# Altium schematic sheet SCH2_Main_Computer.SchDoc: Main Computer
size B; Organization: CWRUbotix; Address1: 10900 Euclid Avenue; Address2: Cleveland, OH 44106; Address3: USA; Revision: 1.0; SheetNumber: 2; SheetTotal: 13
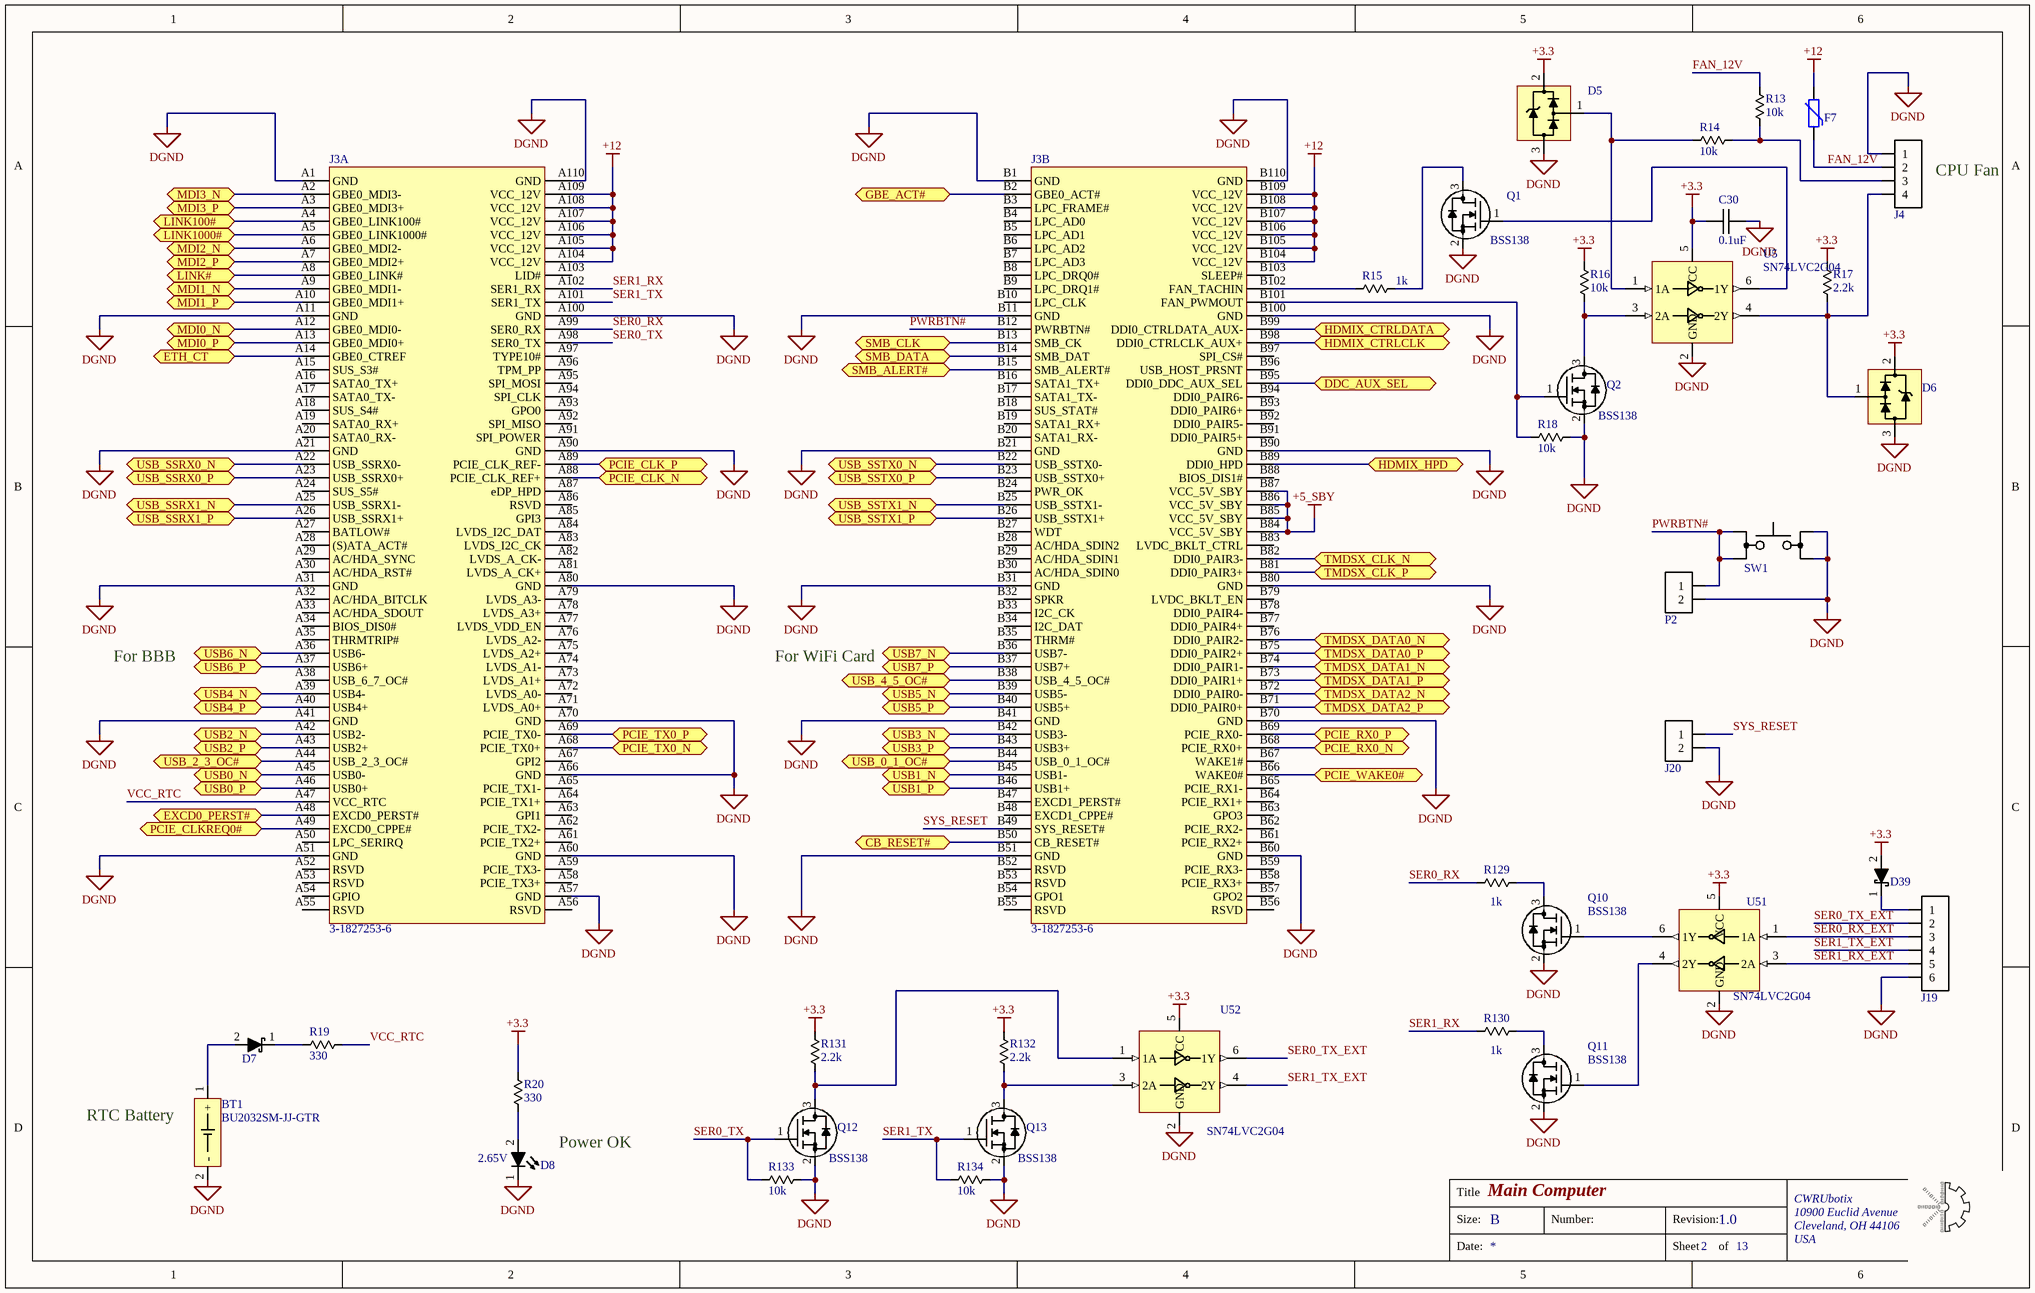
[diagram p0: SCH2_Main_Computer.SchDoc]

## Parts
BT1  BU2032SM-JJ-GTR  [BU2032SM-JJ-GTR]
C30  0.1uF  [chip_0603]
D5  DLPT05  [sot-23-3]  (value not drawn)
D6  DLPT05  [sot-23-3]  (value not drawn)
D7  diode_2  [sod123_0]  (value not drawn)
D8  Forward Voltage: 2.65V  [chip_0603_LED]  (hidden comment: diode_4)
D39  diode_2  [sod123_0]  (value not drawn)
F7  PTC_0  [chip_1210]  (value not drawn)
J3  3-1827253-6  [TE_CONN_1827253]  (parts A,B of 2)
J4  conn-4x1_0  [MOLEX_0470531000]  (value not drawn)
J19  conn-6x1_0  [HDDR_6X1_0]  (value not drawn)
J20  conn-2x1_0  [HDDR_2x1_0]  (value not drawn)
P2  conn-2x1_0  [HDDR_2x1_0]  (value not drawn)
Q1  Manufacturer PN: BSS138  [sot-23-3]  (hidden comment: n-mosfet_1)
Q2  Manufacturer PN: BSS138  [sot-23-3]  (hidden comment: n-mosfet_1)
Q10  Manufacturer PN: BSS138  [sot-23-3]  (hidden comment: n-mosfet_1)
Q11  Manufacturer PN: BSS138  [sot-23-3]  (hidden comment: n-mosfet_1)
Q12  Manufacturer PN: BSS138  [sot-23-3]  (hidden comment: n-mosfet_1)
Q13  Manufacturer PN: BSS138  [sot-23-3]  (hidden comment: n-mosfet_1)
R13  10k  [chip_0603]
R14  10k  [chip_0603]
R15  1k  [chip_0603]
R16  10k  [chip_0603]
R17  2.2k  [chip_0603]
R18  10k  [chip_0603]
R19  330  [chip_0603]
R20  330  [chip_0603]
R129  1k  [chip_0603]
R130  1k  [chip_0603]
R131  2.2k  [chip_0603]
R132  2.2k  [chip_0603]
R133  10k  [chip_0603]
R134  10k  [chip_0603]
SW1  SW_1P1T_2  [B3FS-1000]  (value not drawn)
U5  SN74LVC2G04  [sot-23-6]
U51  SN74LVC2G04  [sot-23-6]
U52  SN74LVC2G04  [sot-23-6]

## Ports
CB_RESET# (bidir), DDC_AUX_SEL (bidir), ETH_CT (bidir), EXCD0_PERST# (bidir), GBE_ACT# (bidir), HDMIX_CTRLCLK (bidir), HDMIX_CTRLDATA (bidir), HDMIX_HPD (bidir), LINK100# (bidir), LINK1000# (bidir), LINK# (bidir), MDI0_N (bidir), MDI0_P (bidir), MDI1_N (bidir), MDI1_P (bidir), MDI2_N (bidir), MDI2_P (bidir), MDI3_N (bidir), MDI3_P (bidir), PCIE_CLK_N (bidir), PCIE_CLK_P (bidir), PCIE_CLKREQ0# (bidir), PCIE_RX0_N (bidir), PCIE_RX0_P (bidir), PCIE_TX0_N (bidir), PCIE_TX0_P (bidir), PCIE_WAKE0# (bidir), SMB_ALERT# (bidir), SMB_CLK (bidir), SMB_DATA (bidir), TMDSX_CLK_N (bidir), TMDSX_CLK_P (bidir), TMDSX_DATA0_N (bidir), TMDSX_DATA0_P (bidir), TMDSX_DATA1_N (bidir), TMDSX_DATA1_P (bidir), TMDSX_DATA2_N (bidir), TMDSX_DATA2_P (bidir), USB0_N (bidir), USB0_P (bidir), USB1_N (bidir), USB1_P (bidir), USB2_N (bidir), USB2_P (bidir), USB3_N (bidir), USB3_P (bidir), USB4_N (bidir), USB4_P (bidir), USB5_N (bidir), USB5_P (bidir), USB6_N (bidir), USB6_P (bidir), USB7_N (bidir), USB7_P (bidir), USB_0_1_OC# (bidir), USB_2_3_OC# (bidir), USB_4_5_OC# (bidir), USB_SSRX0_N (bidir), USB_SSRX0_P (bidir), USB_SSRX1_N (bidir), USB_SSRX1_P (bidir), USB_SSTX0_N (bidir), USB_SSTX0_P (bidir), USB_SSTX1_N (bidir), USB_SSTX1_P (bidir)

## Nets
+3.3: C30.1 D5.2(VCC) D6.2(VCC) D39.2 R16.1 R17.1 R20.2 R131.1 R132.1 U5.5(VCC) U51.5(VCC) U52.5(VCC)
+5_SBY: J3.B84(VCC_5V_SBY) J3.B85(VCC_5V_SBY) J3.B86(VCC_5V_SBY) J3.B87(VCC_5V_SBY)
+12: F7.2 J3.A104(VCC_12V) J3.A105(VCC_12V) J3.A106(VCC_12V) J3.A107(VCC_12V) J3.A108(VCC_12V) J3.A109(VCC_12V) J3.B104(VCC_12V) J3.B105(VCC_12V) J3.B106(VCC_12V) J3.B107(VCC_12V) J3.B108(VCC_12V) J3.B109(VCC_12V)
DGND: BT1.2(-) C30.2 D5.3(GND) D6.3(GND) D8.1 J3.A1(GND) J3.A11(GND) J3.A21(GND) J3.A31(GND) J3.A41(GND) J3.A51(GND) J3.A57(GND) J3.A60(GND) J3.A66(GND) J3.A70(GND) J3.A80(GND) J3.A90(GND) J3.A100(GND) J3.A110(GND) J3.B1(GND) J3.B11(GND) J3.B21(GND) J3.B31(GND) J3.B41(GND) J3.B51(GND) J3.B60(GND) J3.B70(GND) J3.B80(GND) J3.B90(GND) J3.B100(GND) J3.B110(GND) J4.1 J19.6 J20.2 P2.2 Q1.2(S) Q2.2(S) Q10.2(S) Q11.2(S) Q12.2(S) Q13.2(S) R18.2 R133.2 R134.2 SW1.3 SW1.4 U5.2(GND) U51.2(GND) U52.2(GND)
CB_RESET#: J3.B50(CB_RESET#) ; port CB_RESET#
DDC_AUX_SEL: J3.B95(DDI0_DDC_AUX_SEL) ; port DDC_AUX_SEL
ETH_CT: J3.A14(GBE0_CTREF) ; port ETH_CT
EXCD0_PERST#: J3.A48(EXCD0_PERST#) ; port EXCD0_PERST#
FAN_12V: F7.1 J4.2 R13.2
GBE_ACT#: J3.B2(GBE0_ACT#) ; port GBE_ACT#
HDMIX_CTRLCLK: J3.B98(DDI0_CTRLCLK_AUX+) ; port HDMIX_CTRLCLK
HDMIX_CTRLDATA: J3.B99(DDI0_CTRLDATA_AUX-) ; port HDMIX_CTRLDATA
HDMIX_HPD: J3.B89(DDI0_HPD) ; port HDMIX_HPD
LINK100#: J3.A4(GBE0_LINK100#) ; port LINK100#
LINK1000#: J3.A5(GBE0_LINK1000#) ; port LINK1000#
LINK#: J3.A8(GBE0_LINK#) ; port LINK#
MDI0_N: J3.A12(GBE0_MDI0-) ; port MDI0_N
MDI0_P: J3.A13(GBE0_MDI0+) ; port MDI0_P
MDI1_N: J3.A9(GBE0_MDI1-) ; port MDI1_N
MDI1_P: J3.A10(GBE0_MDI1+) ; port MDI1_P
MDI2_N: J3.A6(GBE0_MDI2-) ; port MDI2_N
MDI2_P: J3.A7(GBE0_MDI2+) ; port MDI2_P
MDI3_N: J3.A2(GBE0_MDI3-) ; port MDI3_N
MDI3_P: J3.A3(GBE0_MDI3+) ; port MDI3_P
PCIE_CLK_N: J3.A88(PCIE_CLK_REF+) ; port PCIE_CLK_N
PCIE_CLK_P: J3.A89(PCIE_CLK_REF-) ; port PCIE_CLK_P
PCIE_CLKREQ0#: J3.A49(EXCD0_CPPE#) ; port PCIE_CLKREQ0#
PCIE_RX0_N: J3.B68(PCIE_RX0+) ; port PCIE_RX0_N
PCIE_RX0_P: J3.B69(PCIE_RX0-) ; port PCIE_RX0_P
PCIE_TX0_N: J3.A68(PCIE_TX0+) ; port PCIE_TX0_N
PCIE_TX0_P: J3.A69(PCIE_TX0-) ; port PCIE_TX0_P
PCIE_WAKE0#: J3.B66(WAKE0#) ; port PCIE_WAKE0#
PWRBTN#: J3.B12(PWRBTN#) P2.1 SW1.1 SW1.2
SER0_RX: J3.A99(SER0_RX) R129.1
SER0_RX_EXT: J19.3 U51.1(1A)
SER0_TX: J3.A98(SER0_TX) Q12.1(G) R133.1
SER0_TX_EXT: J19.2 U52.6(1Y)
SER1_RX: J3.A102(SER1_RX) R130.1
SER1_RX_EXT: J19.5 U51.3(2A)
SER1_TX: J3.A101(SER1_TX) Q13.1(G) R134.1
SER1_TX_EXT: J19.4 U52.4(2Y)
SMB_ALERT#: J3.B15(SMB_ALERT#) ; port SMB_ALERT#
SMB_CLK: J3.B13(SMB_CK) ; port SMB_CLK
SMB_DATA: J3.B14(SMB_DAT) ; port SMB_DATA
SYS_RESET: J3.B49(SYS_RESET#) J20.1
TMDSX_CLK_N: J3.B82(DDI0_PAIR3-) ; port TMDSX_CLK_N
TMDSX_CLK_P: J3.B81(DDI0_PAIR3+) ; port TMDSX_CLK_P
TMDSX_DATA0_N: J3.B76(DDI0_PAIR2-) ; port TMDSX_DATA0_N
TMDSX_DATA0_P: J3.B75(DDI0_PAIR2+) ; port TMDSX_DATA0_P
TMDSX_DATA1_N: J3.B74(DDI0_PAIR1-) ; port TMDSX_DATA1_N
TMDSX_DATA1_P: J3.B73(DDI0_PAIR1+) ; port TMDSX_DATA1_P
TMDSX_DATA2_N: J3.B72(DDI0_PAIR0-) ; port TMDSX_DATA2_N
TMDSX_DATA2_P: J3.B71(DDI0_PAIR0+) ; port TMDSX_DATA2_P
USB0_N: J3.A45(USB0-) ; port USB0_N
USB0_P: J3.A46(USB0+) ; port USB0_P
USB1_N: J3.B45(USB1-) ; port USB1_N
USB1_P: J3.B46(USB1+) ; port USB1_P
USB2_N: J3.A42(USB2-) ; port USB2_N
USB2_P: J3.A43(USB2+) ; port USB2_P
USB3_N: J3.B42(USB3-) ; port USB3_N
USB3_P: J3.B43(USB3+) ; port USB3_P
USB4_N: J3.A39(USB4-) ; port USB4_N
USB4_P: J3.A40(USB4+) ; port USB4_P
USB5_N: J3.B39(USB5-) ; port USB5_N
USB5_P: J3.B40(USB5+) ; port USB5_P
USB6_N: J3.A36(USB6-) ; port USB6_N
USB6_P: J3.A37(USB6+) ; port USB6_P
USB7_N: J3.B36(USB7-) ; port USB7_N
USB7_P: J3.B37(USB7+) ; port USB7_P
USB_0_1_OC#: J3.B44(USB_0_1_OC#) ; port USB_0_1_OC#
USB_2_3_OC#: J3.A44(USB_2_3_OC#) ; port USB_2_3_OC#
USB_4_5_OC#: J3.B38(USB_4_5_OC#) ; port USB_4_5_OC#
USB_SSRX0_N: J3.A22(USB_SSRX0-) ; port USB_SSRX0_N
USB_SSRX0_P: J3.A23(USB_SSRX0+) ; port USB_SSRX0_P
USB_SSRX1_N: J3.A25(USB_SSRX1-) ; port USB_SSRX1_N
USB_SSRX1_P: J3.A26(USB_SSRX1+) ; port USB_SSRX1_P
USB_SSTX0_N: J3.B22(USB_SSTX0-) ; port USB_SSTX0_N
USB_SSTX0_P: J3.B23(USB_SSTX0+) ; port USB_SSTX0_P
USB_SSTX1_N: J3.B25(USB_SSTX1-) ; port USB_SSTX1_N
USB_SSTX1_P: J3.B26(USB_SSTX1+) ; port USB_SSTX1_P
VCC_RTC: J3.A47(VCC_RTC) R19.2
NetBT1_1: BT1.1(+) D7.2
NetD5_1: D5.1(LINE) R14.1 U5.1(1A)
NetD6_1: D6.1(LINE) J4.4 R17.2 U5.4(2Y)
NetD7_1: D7.1 R19.1
NetD8_2: D8.2 R20.1
NetD39_1: D39.1 J19.1
NetJ3_B101: J3.B101(FAN_PWMOUT) Q2.1(G) R18.1
NetJ3_B102: J3.B102(FAN_TACHIN) R15.1
NetJ4_3: J4.3 R13.1 R14.2
NetQ1_1: Q1.1(G) U5.6(1Y)
NetQ1_3: Q1.3(D) R15.2
NetQ2_3: Q2.3(D) R16.2 U5.3(2A)
NetQ10_1: Q10.1(G) U51.6(1Y)
NetQ10_3: Q10.3(D) R129.2
NetQ11_1: Q11.1(G) U51.4(2Y)
NetQ11_3: Q11.3(D) R130.2
NetQ12_3: Q12.3(D) R131.2 U52.1(1A)
NetQ13_3: Q13.3(D) R132.2 U52.3(2A)

Not connected (* = marked no-connect by the designer): J3 A15(SUS_S3#) A16(SATA0_TX+) A17(SATA0_TX-) A18(SUS_S4#) A19(SATA0_RX+) A20(SATA0_RX-) A24(SUS_S5#) A27(BATLOW#) A28((S)ATA_ACT#) A29(AC/HDA_SYNC) A30(AC/HDA_RST#) A32(AC/HDA_BITCLK) A33(AC/HDA_SDOUT) A34(BIOS_DIS0#) A35(THRMTRIP#) A38(USB_6_7_OC#) A50(LPC_SERIRQ) A52(RSVD) A53(RSVD) A54(GPIO) A55(RSVD) A56(RSVD) A58(PCIE_TX3+) A59(PCIE_TX3-) A61(PCIE_TX2+) A62(PCIE_TX2-) A63(GPI1) A64(PCIE_TX1+) A65(PCIE_TX1-) A67(GPI2) A71(LVDS_A0+) A72(LVDS_A0-) A73(LVDS_A1+) A74(LVDS_A1-) A75(LVDS_A2+) A76(LVDS_A2-) A77(LVDS_VDD_EN) A78(LVDS_A3+) A79(LVDS_A3-) A81(LVDS_A_CK+) A82(LVDS_A_CK-) A83(LVDS_I2C_CK) A84(LVDS_I2C_DAT) A85(GPI3) A86(RSVD) A87(eDP_HPD) A91(SPI_POWER) A92(SPI_MISO) A93(GPO0) A94(SPI_CLK) A95(SPI_MOSI) A96(TPM_PP) A97(TYPE10#) A103(LID#) B3(LPC_FRAME#) B4(LPC_AD0) B5(LPC_AD1) B6(LPC_AD2) B7(LPC_AD3) B8(LPC_DRQ0#) B9(LPC_DRQ1#) B10(LPC_CLK) B16(SATA1_TX+) B17(SATA1_TX-) B18(SUS_STAT#) B19(SATA1_RX+) B20(SATA1_RX-) B24(PWR_OK) B27(WDT) B28(AC/HDA_SDIN2) B29(AC/HDA_SDIN1) B30(AC/HDA_SDIN0) B32(SPKR) B33(I2C_CK) B34(I2C_DAT) B35(THRM#) B47(EXCD1_PERST#) B48(EXCD1_CPPE#) B52(RSVD) B53(RSVD) B54(GPO1) B55(RSVD) B56(RSVD) B57(GPO2) B58(PCIE_RX3+) B59(PCIE_RX3-) B61(PCIE_RX2+) B62(PCIE_RX2-) B63(GPO3) B64(PCIE_RX1+) B65(PCIE_RX1-) B67(WAKE1#) B77(DDI0_PAIR4+) B78(DDI0_PAIR4-) B79(LVDC_BKLT_EN) B83(LVDC_BKLT_CTRL) B88(BIOS_DIS1#) B91(DDI0_PAIR5+) B92(DDI0_PAIR5-) B93(DDI0_PAIR6+) B94(DDI0_PAIR6-) B96(USB_HOST_PRSNT) B97(SPI_CS#) B103(SLEEP#)

## Notes on the sheet
- (near J4) CPU Fan
- For BBB
- For WiFi Card
- (near BT1) RTC Battery
- Power OK
- Title
- Size:
- B
- Number:
- Revision:
- Date:
- Sheet
- of

## Library data of the parts
BT1 = CONN-00083: Battery Holder, Coin Cell CR2032, SMD; Manufacturer: Memory Protection Devices; Part Number: CONN-00083; Manufacturer PN: BU2032SM-JJ-GTR; Cost: 1
C30 = CAP-00542: CAP, 0.1uF, ±10%, 16V, X7R, 0603; Manufacturer: Murata; Part Number: CAP-00542; Capacitance: 0.1uF; Tolerance: ±10%; Voltage Rating: 16V; Type: X7R
D5 D6 = DIO-00057: TVS, Steering (Rail-Rail), 9.8V Clamping, 17A Peak Pulse, SOT-23; Manufacturer: Diodes Incorporated; Manufacturer PN: DLPT05-7-F; Reverse Breakdown Voltage: 6.0V; Part Number: DIO-00057; Type: TVS; Cost: 0.38
D7 D39 = DIO-00001: Dio Shtky, 1A, 0.55V, 40V, SOD-123; Manufacturer: ON Semi; Manufacturer PN: MBR140SFT1G; Forward Voltage: 550mV; Type: Schottky; Part Number: DIO-00001; Reverse Breakdown Voltage: 40V; Current Rating: 1A
D8 = DIO-00049: LED, Blue, 0603, Low current, HELI2 Series; Manufacturer: Kingbright; Manufacturer PN: APT1608LVBC/D; Reverse Breakdown Voltage: 5V; Power Rating: 120mW; Current Rating: 30mA; Part Number: DIO-00049; Type: LED; Cost: 0.58
F7 = MISC-00056: PTC Fuse (Polyfuse), 16V 1.5A Hold, 3A Trip, 300ms; Manufacturer: Littelfuse; Manufacturer PN: 1210L150/16WR; Part Number: MISC-00056; Cost: 1
J3 = CONN-00078: Plug, 220 pos, COM Express Board-Board connector; Manufacturer: TE Connectivity; Positions per level: 110; Levels: 2; Part Number: CONN-00078; Type: Plug; Manufacturer PN: 3-1827253-6; Cost: 18.99
J4 = CONN-00087: Header, 4-Pos, Molex-47053, (CPU Fan Header); Manufacturer: Molex; Manufacturer PN: 0470531000; Positions per level: 4; Levels: 1; Part Number: CONN-00087; Type: Header; Cost: 0.46
J19 = CONN-00008: Header 6x1, 0.1"; Positions per level: 6; Levels: 1; Part Number: CONN-00008
J20 P2 = CONN-00055: Header, 2x1, 0.1"; Manufacturer: Samtec; Manufacturer PN: TSW-102-07-F-S; Positions per level: 2; Levels: 1; Part Number: CONN-00055; Type: Header; Cost: 0.2
Q1 Q2 Q10-Q13 = XSTR-00017: XSTR NMOS, 220mA, 50V, Vgs 1.3V, SOT-23-3; Manufacturer: ON Semi; Max Power: 360mW; Type: NFET; Part Number: XSTR-00017; Max Voltage: 50V; Max Current: 220mA; Vgs/Vce: 1.3V; Cost: 0.31
R13 R14 R16 R18 R133 R134 = RES-00306: RES SMD 10K OHM 1% 1/4W 0603; Manufacturer: Panasonic; Manufacturer PN: ERJ-PA3F1002V; Power Rating: 0.25W; Part Number: RES-00306; Resistance: 10k; Tolerance: 1%; Cost: 0.144
R15 R129 R130 = RES-00360: RES SMD 1K OHM 1% 1/4W 0603; Manufacturer: Panasonic; Manufacturer PN: ERJ-PA3F1001V; Power Rating: 0.25W; Part Number: RES-00360; Resistance: 1k; Tolerance: 1%
R17 R131 R132 = RES-00365: RES SMD 2.2K OHM 1% 1/4W 0603; Manufacturer: Panasonic; Manufacturer PN: ERJ-PA3F2201V; Power Rating: 0.25W; Part Number: RES-00365; Resistance: 2.2k; Tolerance: 1%
R19 R20 = RES-00221: RES SMD 330 OHM 1% 1/4W 0603; Manufacturer: Panasonic; Manufacturer PN: ERJ-PA3F3300V; Power Rating: 0.25W; Part Number: RES-00221; Resistance: 330; Tolerance: 1%
SW1 = MISC-00042: Switch, SPST-NO, Tactile, 6.3x6.0mm, SMD, 50mA 24VDC; Manufacturer: Omron; Manufacturer PN: B3FS-1012P; Part Number: MISC-00042; Cost: 0.71
U5 U51 U52 = LOGIC-00001: Inverter, Dual, sot-23-6, SN74LVC2G04; Manufacturer: TI; Part Number: LOGIC-00001; Manufacturer PN: SN74LVC2G04